# Altium schematic sheet Bike_Light_PCB_2017_Control.SchDoc
size A
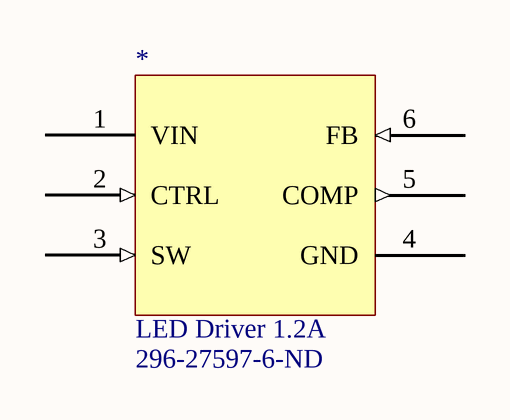
[diagram p0: Bike_Light_PCB_2017_Control.SchDoc]

## Parts
*  LED Driver 1.2A  Supplier Part Number 1: 296-27597-6-ND

## Nets

Not connected (* = marked no-connect by the designer): * 1(VIN) 2(CTRL) 3(SW) 4(GND) 5(COMP) 6(FB)

## Library data of the parts
* = LED Driver 1.2A: Supplier 1: Digi-Key